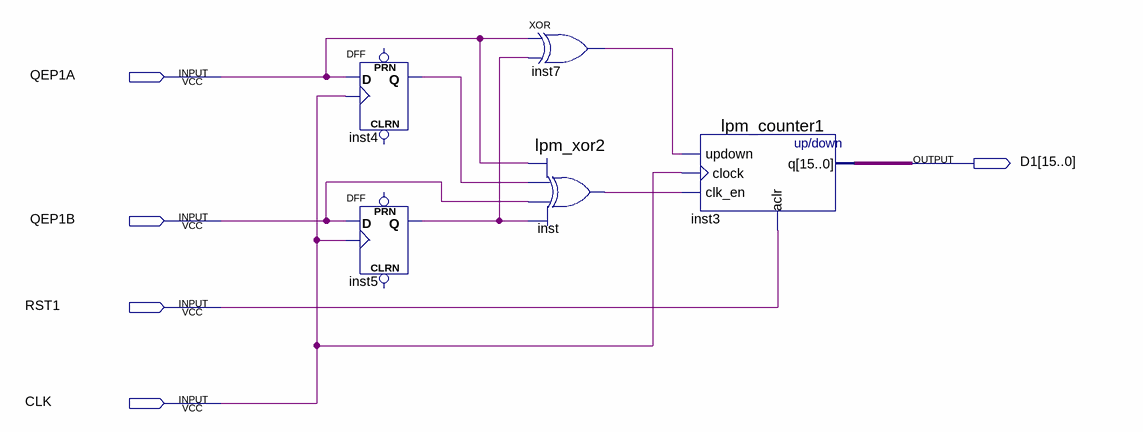
[diagram p0: schematic sheet]
// Quartus schematic encoder.bdf as structural Verilog: 5 symbols, 5 pins
module encoder (
  input  QEP1A,
  input  QEP1B,
  input  RST1,
  input  CLK,
  output [15:0] D1
);

  wire inst4_q, inst5_q, inst7_out, inst_result;

  DFF inst4 (.CLK(CLK), .D(QEP1A), .Q(inst4_q));  // open: CLRN, PRN
  DFF inst5 (.CLK(CLK), .D(QEP1B), .Q(inst5_q));  // open: CLRN, PRN
  xor inst7 (inst7_out, QEP1A, inst5_q);
  lpm_xor2 inst (.data0(QEP1A), .data1(inst4_q), .data2(QEP1B), .data3(inst5_q), .result(inst_result));
  lpm_counter1 inst3 (.updown(inst7_out), .clock(CLK), .clk_en(inst_result), .aclr(RST1), .q(D1));
endmodule
